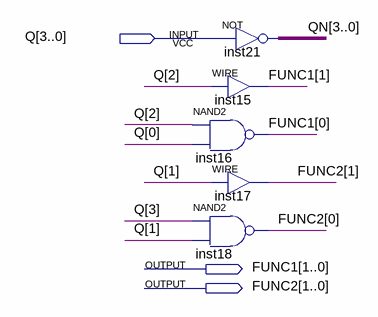
[diagram p0: schematic sheet]
// Quartus schematic FUNC.bdf as structural Verilog: 5 symbols, 3 pins
module FUNC (
  input  [3:0] Q,
  output [1:0] FUNC1,
  output [1:0] FUNC2
);

  wire [3:0] QN;

  assign QN = ~Q;  // NOT inst21, 4 bits wide
  assign FUNC1[1] = Q[2];  // WIRE inst15
  nand inst16 (FUNC1[0], Q[2], Q[0]);
  assign FUNC2[1] = Q[1];  // WIRE inst17
  nand inst18 (FUNC2[0], Q[3], Q[1]);
endmodule
